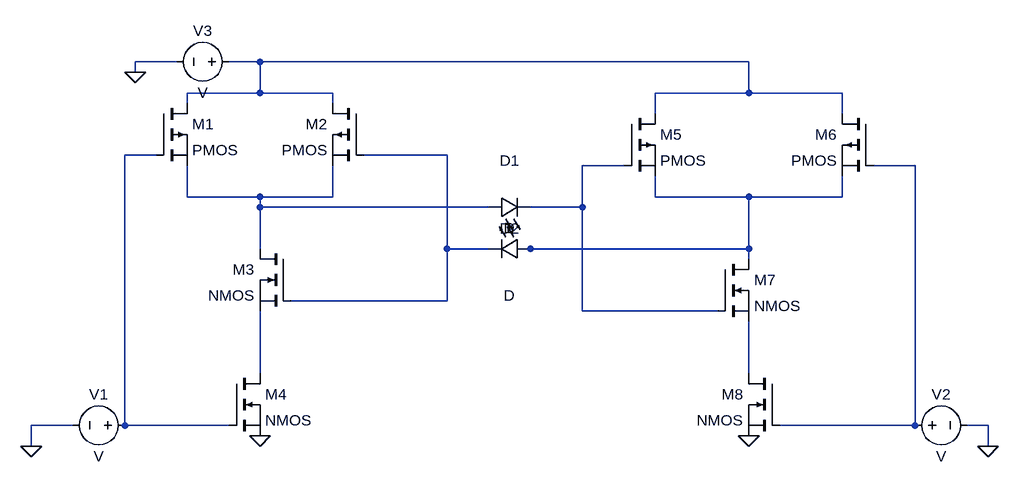
[diagram p0: schematic SR_Latch.asc]
SR_Latch.asc, the LTspice schematic file:
Version 4
SHEET 1 1332 680
WIRE 64 48 0 48
WIRE 192 48 144 48
WIRE 944 48 192 48
WIRE 0 64 0 48
WIRE 192 96 192 48
WIRE 192 96 80 96
WIRE 304 96 192 96
WIRE 944 96 944 48
WIRE 944 96 800 96
WIRE 1088 96 944 96
WIRE 80 112 80 96
WIRE 304 112 304 96
WIRE 800 128 800 96
WIRE 1088 128 1088 96
WIRE 32 192 -16 192
WIRE 480 192 352 192
WIRE 752 208 688 208
WIRE 1200 208 1136 208
WIRE 80 256 80 208
WIRE 192 256 80 256
WIRE 304 256 304 208
WIRE 304 256 192 256
WIRE 800 256 800 224
WIRE 944 256 800 256
WIRE 1088 256 1088 224
WIRE 1088 256 944 256
WIRE 192 272 192 256
WIRE 544 272 192 272
WIRE 688 272 688 208
WIRE 688 272 608 272
WIRE 192 336 192 272
WIRE 480 336 480 192
WIRE 544 336 480 336
WIRE 608 336 592 336
WIRE 944 336 944 256
WIRE 944 336 608 336
WIRE 944 352 944 336
WIRE 480 416 480 336
WIRE 480 416 240 416
WIRE 688 432 688 272
WIRE 896 432 688 432
WIRE 192 528 192 432
WIRE 944 528 944 448
WIRE -96 608 -160 608
WIRE -16 608 -16 192
WIRE 144 608 -16 608
WIRE 1200 608 1200 208
WIRE 1200 608 992 608
WIRE 1312 608 1280 608
WIRE -160 640 -160 608
WIRE 1312 640 1312 608
FLAG 192 624 0
FLAG -160 640 0
FLAG 944 624 0
FLAG 1312 640 0
FLAG 0 64 0
SYMBOL pmos 32 112 R0
SYMATTR InstName M1
SYMBOL pmos 352 112 M0
SYMATTR InstName M2
SYMBOL nmos 240 336 M0
SYMATTR InstName M3
SYMBOL nmos 144 528 R0
SYMATTR InstName M4
SYMBOL voltage 0 608 R90
WINDOW 0 -32 56 VBottom 2
WINDOW 3 32 56 VTop 2
SYMATTR InstName V1
SYMBOL pmos 752 128 R0
SYMATTR InstName M5
SYMBOL pmos 1136 128 M0
SYMATTR InstName M6
SYMBOL nmos 896 352 R0
SYMATTR InstName M7
SYMBOL nmos 992 528 M0
SYMATTR InstName M8
SYMBOL voltage 1184 608 R270
WINDOW 0 32 56 VTop 2
WINDOW 3 -32 56 VBottom 2
SYMATTR InstName V2
SYMBOL voltage 160 48 R90
WINDOW 0 -32 56 VBottom 2
WINDOW 3 32 56 VTop 2
SYMATTR InstName V3
SYMBOL LED 544 288 R270
WINDOW 0 72 32 VTop 2
WINDOW 3 0 32 VBottom 2
SYMATTR InstName D1
SYMBOL LED 608 320 R90
WINDOW 0 0 32 VBottom 2
WINDOW 3 72 32 VTop 2
SYMATTR InstName D2

The netlist it stands for:
* SR_Latch.asc
M1 N001 N002 N006 N006 PMOS
M2 N001 N003 N006 N006 PMOS
M3 N006 N003 N008 N008 NMOS
M4 N008 N002 0 0 NMOS
V1 N002 0 V
M5 N001 N004 N007 N007 PMOS
M6 N001 N005 N007 N007 PMOS
M7 N007 N004 N009 N009 NMOS
M8 N009 N005 0 0 NMOS
V2 N005 0 V
V3 N001 0 V
D1 N006 N004 D
D2 N007 N003 D
.model D D
.lib standard.dio
.model NMOS NMOS
.model PMOS PMOS
.lib standard.mos
.backanno
.end